# Altium project arduino_nano.PrjPcb
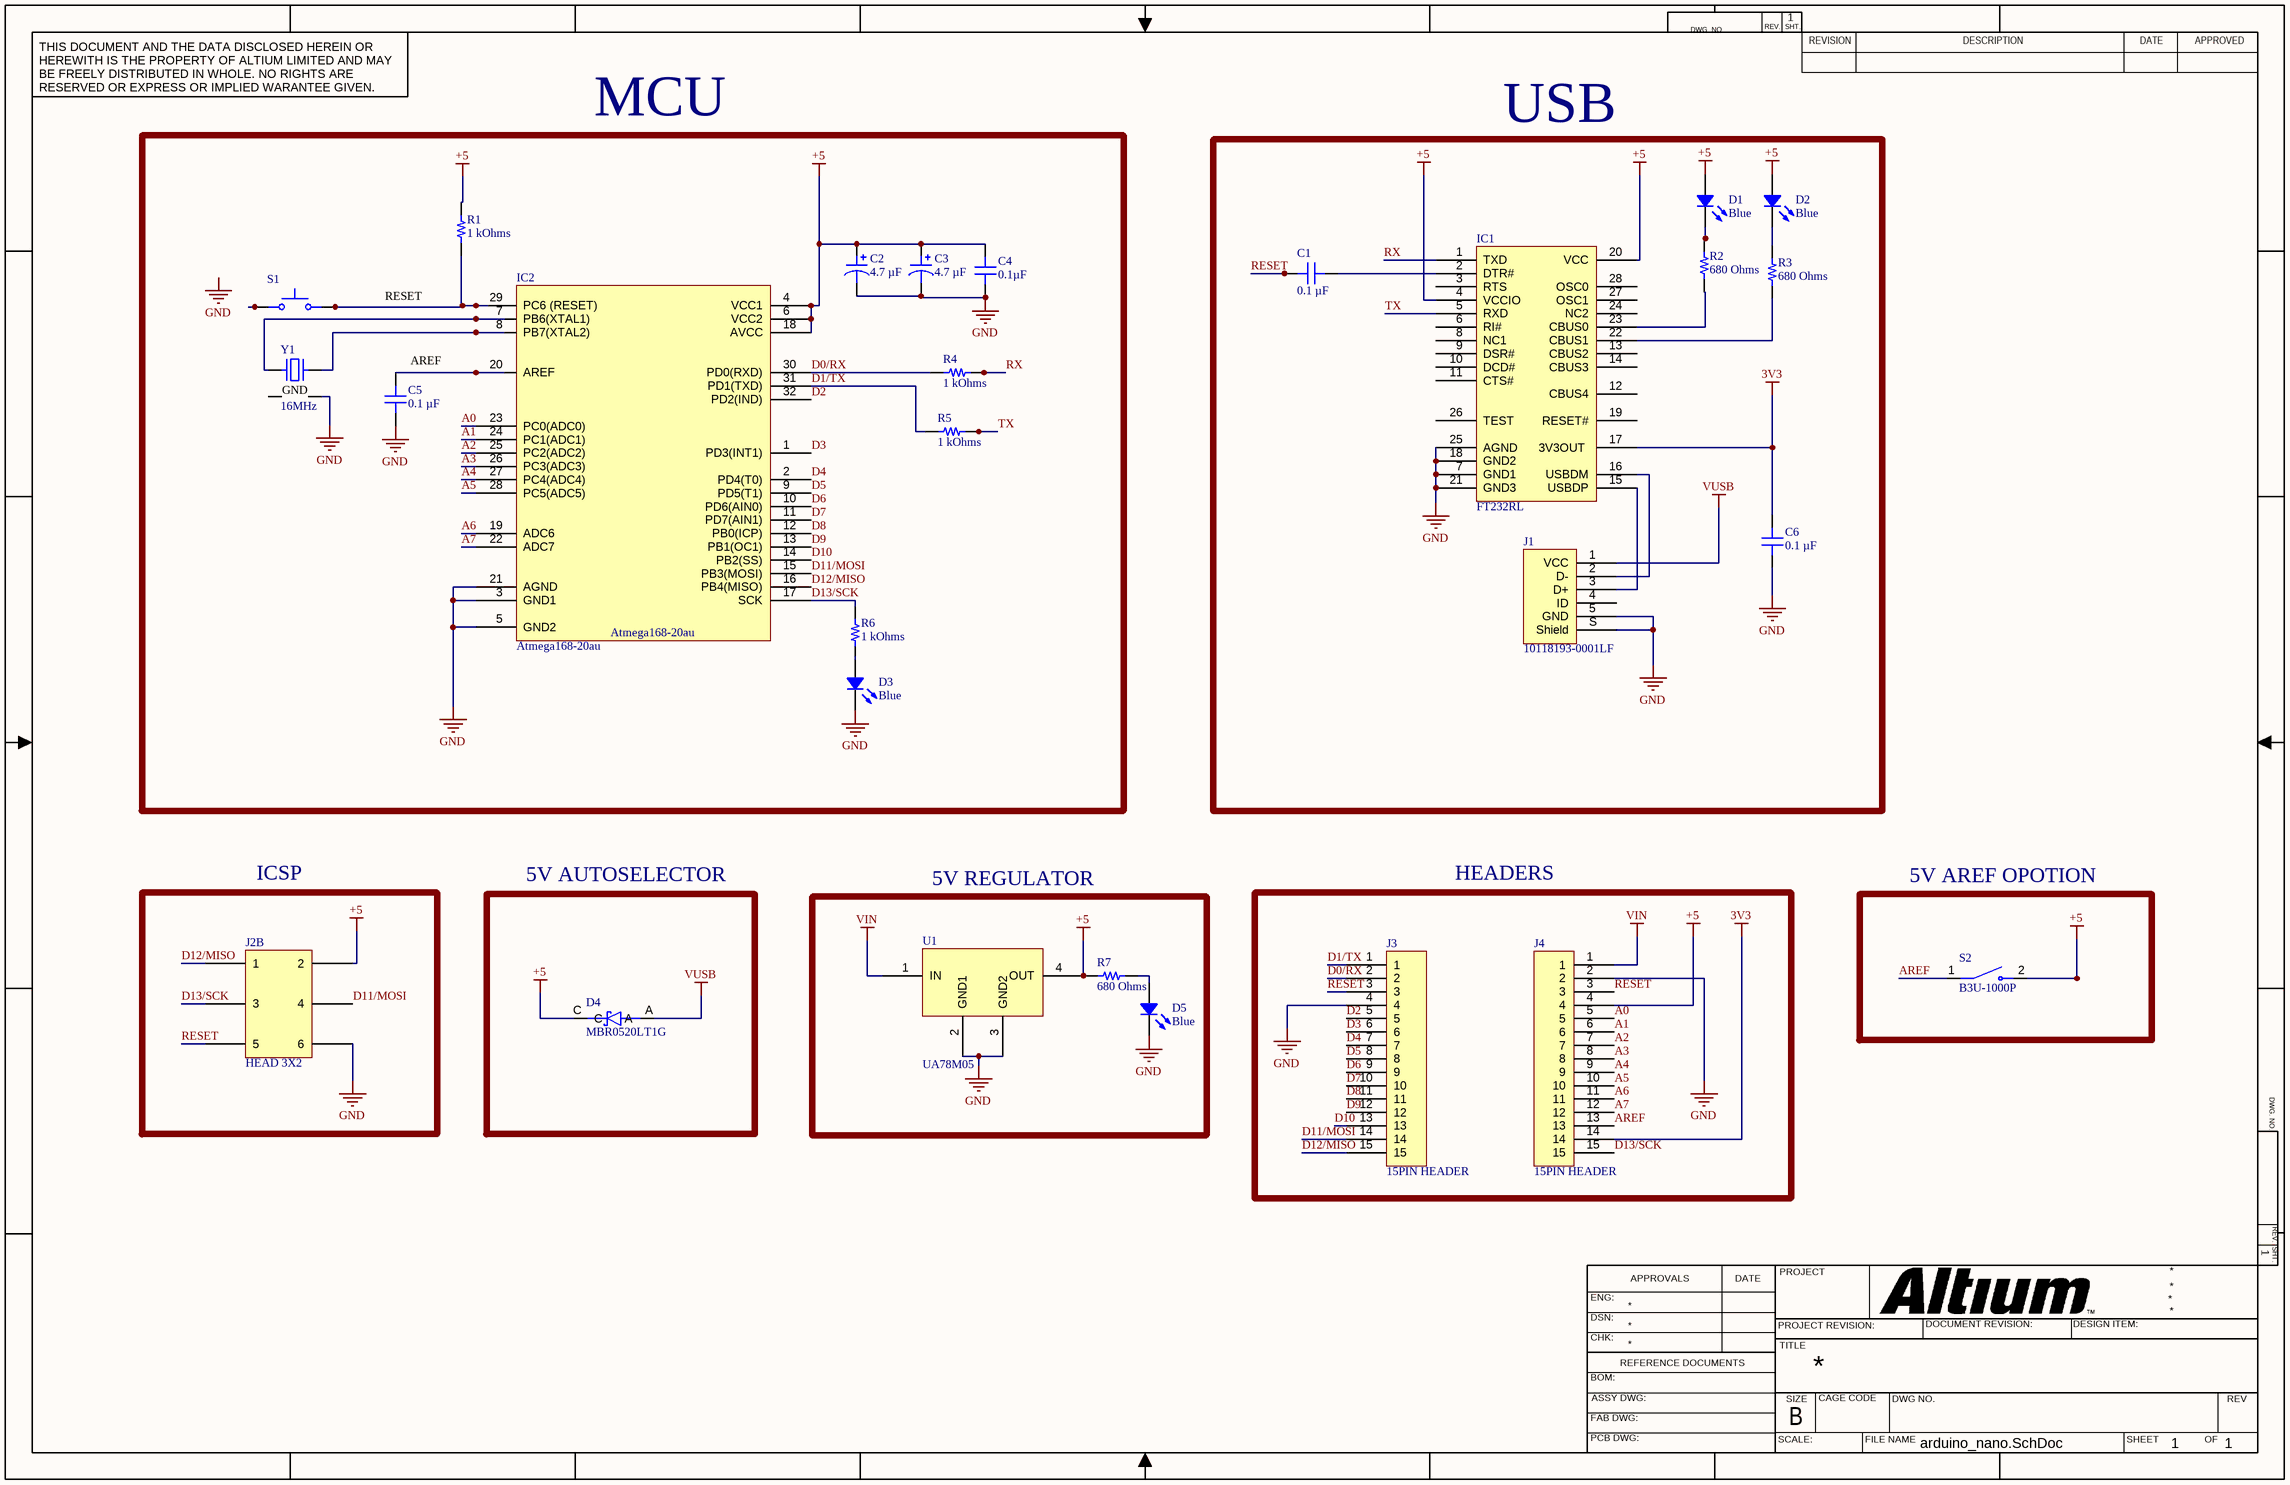
[diagram p0: arduino_nano.SchDoc]
1 sheet, 28 parts. Net scope: global (net labels, ports and power ports of the same name join across sheets).
Board file: arduino_nano.PcbDoc

## Sheet arduino_nano.SchDoc
size 431 x 279 mm; SheetNumber: 1; SheetTotal: 1

### Parts
C1  0.1 µF  [CAP 0402_1005]
C2  4.7 µF  [CAP POL 1411_3528]
C3  4.7 µF  [CAP POL 1411_3528]
C4  0.1µF  [CAP 0402_1005]
C5  0.1 µF  [CAP 0402_1005]
C6  0.1 µF  [CAP 0402_1005]
D1  Blue  [LED 0805_2012 BLUE]
D2  Blue  [LED 0805_2012 BLUE]
D3  Blue  [LED 0805_2012 BLUE]
D4  MBR0520LT1G  [SOD3716X135N]
D5  Blue  [LED 0805_2012 BLUE]
IC1  FT232RL  [FT232RL]
IC2  Atmega168-20au  [atmega168-20au]
J1  10118193-0001LF  [FCI USB 10118193-0001LF]
J2  HEAD 3X2  [Header 3x2]  (part B of 2)
J3  15PIN HEADER  [header 1x15]
J4  15PIN HEADER  [header 1x15]
R1  1 kOhms  [RES 0201_0603]
R2  680 Ohms  [RES 0201_0603]
R3  680 Ohms  [RES 0201_0603]
R4  1 kOhms  [RES 0201_0603]
R5  1 kOhms  [RES 0201_0603]
R6  1 kOhms  [RES 0201_0603]
R7  680 Ohms  [RES 0201_0603]
S1  TL3315NF100Q  [SW_TL3315NF100Q]  (value not drawn)
S2  B3U-1000P  [SW_B3U-1000P]
U1  UA78M05  [UA78M05]
Y1  16MHz  [ABRACON ABM10]

### Blocks framed on the sheet
MCU: C2-C5 D3 IC2 R1 R4-R6 S1 Y1
USB: C1 C6 D1 D2 IC1 J1 R2 R3
ICSP: J2
5V AUTOSELECTOR: D4
5V REGULATOR: D5 R7 U1
HEADERS: J3 J4
5V AREF OPOTION: S2

### Nets
3V3: C6.1 IC1.17(3V3OUT) J4.14
+5: C2.1 C3.1 C4.2 D1.1 D2.1 D4.C IC1.4(VCCIO) IC1.20(VCC) IC2.4(VCC1) IC2.6(VCC2) IC2.18(AVCC) J2.2 J4.4 R1.1 R7.2 S2.2 U1.4(OUT)
GND: C2.2 C3.2 C4.1 C5.2 C6.2 D3.2 D5.2 IC1.7(GND1) IC1.18(GND2) IC1.21(GND3) IC1.25(AGND) IC2.3(GND1) IC2.5(GND2) IC2.21(AGND) J1.5(GND) J1.S(Shield) J2.6 J3.4 J4.2 U1.2(GND1) U1.3(GND2) Y1.2(GND)
VIN: J4.1 U1.1(IN)
VUSB: D4.A J1.1(VCC)
A0: IC2.23(PC0(ADC0)) J4.5
A1: IC2.24(PC1(ADC1)) J4.6
A2: IC2.25(PC2(ADC2)) J4.7
A3: IC2.26(PC3(ADC3)) J4.8
A4: IC2.27(PC4(ADC4)) J4.9
A5: IC2.28(PC5(ADC5)) J4.10
A6: IC2.19(ADC6) J4.11
A7: IC2.22(ADC7) J4.12
AREF: J4.13 S2.1
D0/RX: IC2.30(PD0(RXD)) J3.2 R4.2
D1/TX: IC2.31(PD1(TXD)) J3.1 R5.2
D2: IC2.32(PD2(IND)) J3.5
D3: IC2.1(PD3(INT1)) J3.6
D4: IC2.2(PD4(T0)) J3.7
D5: IC2.9(PD5(T1)) J3.8
D6: IC2.10(PD6(AIN0)) J3.9
D7: IC2.11(PD7(AIN1)) J3.10
D8: IC2.12(PB0(ICP)) J3.11
D9: IC2.13(PB1(OC1)) J3.12
D10: IC2.14(PB2(SS)) J3.13
D11/MOSI: IC2.15(PB3(MOSI)) J2.4 J3.14
D12/MISO: IC2.16(PB4(MISO)) J2.1 J3.15
D13/SCK: IC2.17(SCK) J2.3 J4.15 R6.1
RESET: C1.1 J2.5 J3.3 J4.3
RX: IC1.1(TXD) R4.1
TX: IC1.5(RXD) R5.1
NetC1_2: C1.2 IC1.2(DTR#)
NetC5_1: C5.1 IC2.20(AREF)
NetD1_2: D1.2 R2.2
NetD2_2: D2.2 R3.2
NetD3_1: D3.1 R6.2
NetD5_1: D5.1 R7.1
NetIC1_15: IC1.15(USBDP) J1.3(D+)
NetIC1_16: IC1.16(USBDM) J1.2(D-)
NetIC1_22: IC1.22(CBUS1) R3.1
NetIC1_23: IC1.23(CBUS0) R2.1
NetIC2_7: IC2.7(PB6(XTAL1)) Y1.1
NetIC2_8: IC2.8(PB7(XTAL2)) Y1.3
NetIC2_29: IC2.29(PC6_(RESET)) R1.2 S1.3 S1.4
NetS1_1: S1.1 S1.2

Not connected (* = marked no-connect by the designer): IC1 3(RTS) 6(RI#) 8(NC1) 9(DSR#) 10(DCD#) 11(CTS#) 12(CBUS4) 13(CBUS2) 14(CBUS3) 19(RESET#) 24(NC2) 26(TEST) 27(OSC1) 28(OSC0); J1 4(ID); Y1 4(GND)

### Notes on the sheet
- Labels drawn without touching a wire or pin: AREF, GND, RESET
- DWG. NO.
- REV.
- SHT.
- THIS DOCUMENT AND THE DATA DISCLOSED HEREIN OR HEREWITH IS THE PROPERTY OF ALTIUM LIMITED AND MAY BE FREELY DISTRIBUTED IN WHOLE. NO RIGHTS ARE RESERVED OR EXPRESS OR IMPLIED WARANTEE GIVEN.
- REVISION
- DESCRIPTION
- DATE
- APPROVED
- ENG:
- APPROVALS
- PROJECT
- DSN:
- CHK:
- REFERENCE DOCUMENTS
- PROJECT REVISION:
- TITLE
- DOCUMENT REVISION:
- DESIGN ITEM:
- BOM:
- FAB DWG:
- PCB DWG:
- ASSY DWG:
- SCALE:
- SIZE
- B
- CAGE CODE
- FILE NAME
- DWG NO.
- SHEET
- OF
- REV

### Library data of the parts
C1 C6 = GCQ1555C1HR62CB01D: CAP CER 0.62PF 50V C0G/NP0 0402; manufacturer: Murata Electronics; Temperature Coefficient: C0G, NP0; Tolerance: ±0.25pF; Part Number: GCQ1555C1HR62CB01D; Value: 0.1 µF; Applications: RF, Microwave, High Frequency, Automotive; Capacitance: 0.62 pF; componentlink1description: Datasheet; componentlink1url: https://search.murata.co.jp/Ceramy/image/img/A01X/G101/ENG/GCQ1555C1HR62CB01-01.pdf; componentlink2description: DigiKey Link; componentlink2url: https://www.digikey.com/en/products/detail/murata-electronics/GCQ1555C1HR62CB01D/7803284; Device Package: 0402 (1005 Metric); lastupdated: 9/19/2022 12:57:24 PM; Lifecycle Status: Active; Minimum Order: 1; Mounting Type: Surface Mount, MLCC; Operating Temperature: -55°C ~ 125°C; Package / Case: 0402 (1005 Metric); packaging: TapeAndReel; partid: 41932; Part Status: Active; price: 0.04; Ratings: AEC-Q200; series: GCQ; Size / Dimension: 0.039" L x 0.020" W (1.00mm x 0.50mm); Supplier 1: DigiKey; Supplier Part Number 1: 490-17557-1-ND; Thickness (Max): 0.022" (0.55mm); Voltage - Rated: 50V
C2 C3 = TR3B475K025C0700: CAP TANT 4.7UF 10% 25V 1411; manufacturer: Vishay Sprague; Manufacturer Size Code: B; ESR (Equivalent Series Resistance): 700mOhm; Type: Molded; Part Number: TR3B475K025C0700; Value: 4.7 µF; Capacitance: 4.7 µF; componentlink1description: Datasheet; componentlink1url: http://www.vishay.com/docs/40080/tr3.pdf; componentlink2description: DigiKey Link; componentlink2url: https://www.digikey.com/en/products/detail/vishay-sprague/TR3B475K025C0700/1859840; Device Package: 1411 (3528 Metric); Features: General Purpose; Height - Seated (Max): 0.083" (2.11mm); lastupdated: 9/1/2022 1:05:26 PM; Lifecycle Status: Active; Minimum Order: 1; Mounting Type: Surface Mount; Operating Temperature: -55°C ~ 125°C; Package / Case: 1411 (3528 Metric); packaging: TapeAndReel; partid: 2; Part Status: Active; price: 0.46; series: TANTAMOUNT®, TR3; Size / Dimension: 0.138" L x 0.110" W (3.50mm x 2.80mm); Supplier 1: DigiKey; Supplier Part Number 1: 718-1523-1-ND; Tolerance: ±10%; Voltage - Rated: 25 V
C4 = 885012205051: CAP CER 0.015UF 25V X7R 0402; manufacturer: Würth Elektronik; Capacitance: 0.015 µF; Tolerance: ±10%; Part Number: 885012205051; Value: 0.1µF; Applications: General Purpose; componentlink1description: Datasheet; componentlink1url: https://katalog.we-online.de/pbs/datasheet/885012205051.pdf; componentlink2description: DigiKey Link; componentlink2url: https://www.digikey.com/en/products/detail/würth-elektronik/885012205051/5453401; Device Package: 0402 (1005 Metric); lastupdated: 9/19/2022 12:57:34 PM; Lifecycle Status: Active; Minimum Order: 1; Mounting Type: Surface Mount, MLCC; Operating Temperature: -55°C ~ 125°C; Package / Case: 0402 (1005 Metric); packaging: TapeAndReel; partid: 2017; Part Status: Active; price: 0.02; series: WCAP-CSGP; Size / Dimension: 0.039" L x 0.020" W (1.00mm x 0.50mm); Supplier 1: DigiKey; Supplier Part Number 1: 732-7546-1-ND; Temperature Coefficient: X7R; Thickness (Max): 0.022" (0.55mm); Voltage - Rated: 25V
C5 = C0402C151F5GAC7867: CAP CER 150PF 50V NP0 0402; manufacturer: KEMET; Temperature Coefficient: C0G, NP0; Tolerance: ±1%; Part Number: C0402C151F5GAC7867; Value: 0.1 µF; Applications: General Purpose; Capacitance: 150 pF; componentlink1description: Datasheet; componentlink1url: https://api.kemet.com/component-edge/download/datasheet/C0402C151F5GAC7867.pdf; componentlink2description: DigiKey Link; componentlink2url: https://www.digikey.com/en/products/detail/kemet/C0402C151F5GAC7867/2196312; Device Package: 0402 (1005 Metric); Features: Low ESL; lastupdated: 9/19/2022 12:57:36 PM; Lifecycle Status: Active; Minimum Order: 1; Mounting Type: Surface Mount, MLCC; Operating Temperature: -55°C ~ 125°C; Package / Case: 0402 (1005 Metric); packaging: TapeAndReel; partid: 1709; Part Status: Active; price: 0.43; series: SMD Comm C0G; Size / Dimension: 0.039" L x 0.020" W (1.00mm x 0.50mm); Supplier 1: DigiKey; Supplier Part Number 1: 399-14269-1-ND; Thickness (Max): 0.022" (0.55mm); Voltage - Rated: 50V
D1-D3 D5 = 5975606507F: LED BLUE 0805 SMD; Manufacturer: Dialight; Configuration: Standard; Current - Test: 5mA; Lens Color: 0.93mm; Lens Size: 1.40mm x 1.24mm; Lens Style: Rectangle with Flat Top; Millicandela Rating: 36mcd; Voltage - Forward (Vf) (Typ): 2.9V; Wavelength - Dominant: 470nm; Part Number: 5975606507F; Color: Blue; ComponentLink1Description: Datasheet; ComponentLink1URL: http://www.dialightsignalsandcomponents.com/Assets/Drawings/2D_Drawings_DrawingDetailedSpec/NewDrawings/18370A.pdf; ComponentLink2Description: DigiKey Link; ComponentLink2URL: https://www.digikey.com/en/products/detail/dialight/5975606507F/9385445; Device Package: 0805 (2012 Metric); Height (Max): 0.93mm; LastUpdated: 9/1/2022 1:14:53 PM; Lifecycle Status: Active; Minimum Order: 1; Mounting Type: Surface Mount; Package / Case: 0805 (2012 Metric); Packaging: TapeAndReel; PartId: 753; Part Status: Active; Price: 0.14; Series: 597; Size / Dimension: 2.00mm L x 1.25mm W; Supplier 1: DigiKey; Supplier Part Number 1: 350-4390-1-ND; Supplier Device Package: 0805; Value: Blue
D4 = MBR0520LT1G: Rectifier, Schottky Power; Plastic Sod-123; 0.5 a @ +90c If; +125; 20v; 1000; Package: None; MP: MBR0520LT1G; Value: *; Price: None; Availability: Unavailable
J1 = 10118193-0001LF: CONN RCPT USB2.0 MICRO B SMD R/A; Manufacturer: Amphenol ICC (FCI); Connector Type: USB - micro B; Current Rating (Amps): 1.8A per Contact; Gender: Receptacle; Mating Cycles: 10000; Number of Contacts: 5; Number of Ports: 1; Shielding: Shielded; Voltage - Rated: 100VAC; Part Number: 10118193-0001LF; ComponentLink1Description: Datasheet; ComponentLink1URL: https://cdn.amphenol-icc.com/media/wysiwyg/files/documentation/datasheet/inputoutput/io_usb_micro.pdf; ComponentLink2Description: DigiKey Link; ComponentLink2URL: //digikey.com/product-detail/en/amphenol-icc-fci/10118193-0001LF/609-4616-2-ND/2785388; Features: Solder Retention; LastUpdated: 12/9/2019 8:51:28 PM; Lifecycle Status: 0; Minimum Order: 1; Mounting Feature: Horizontal; Mounting Type: Surface Mount, Right Angle; Through Hole; Operating Temperature: -30°C ~ 80°C; Packaging: TapeAndReel; Part Status: Active; Price: 0.21; Series: -; Specifications: USB 2.0; Supplier 1: DigiKey; Supplier Part Number 1: 609-4616-2-ND; Termination: Solder
R1-R7 = 7-2176074-4: RES SMD 33.2KOHM 0.5% 1/32W 0201; Manufacturer: TE Connectivity Passive Product; Power (Watts): 0.03W, 1/32W; Resistance: 33.2 kOhms; Temperature Coefficient: ±50ppm/°C; Part Number: 7-2176074-4; ComponentLink1Description: Datasheet; ComponentLink1URL: https://www.te.com/commerce/DocumentDelivery/DDEController?Action=srchrtrv&DocNm=1773200&DocType=DS&DocLang=English; ComponentLink2Description: DigiKey Link; ComponentLink2URL: https://www.digikey.com/en/products/detail/te-connectivity-passive-product/7-2176074-4/4489517; Composition: Thin Film; Device Package: 0201 (0603 Metric); Height - Seated (Max): 0.011" (0.28mm); LastUpdated: 9/19/2022 1:09:18 PM; Lifecycle Status: Active; Minimum Order: 1; Number of Terminations: 2; Operating Temperature: -55°C ~ 155°C; Package / Case: 0201 (0603 Metric); Packaging: TapeAndReel; PartId: 1; Part Status: Active; Price: 0.10; Series: CPF, Neohm; Size / Dimension: 0.023" L x 0.011" W (0.58mm x 0.29mm); Supplier 1: DigiKey; Supplier Part Number 1: A129571CT-ND; Supplier Device Package: 0201; Tolerance: ±0.5%
  R1 R4-R6: Value: 1 kOhms
  R2 R3 R7: Value: 680 Ohms
S1 = TL3315NF100Q: Tactile Switch SPST-NO Top Actuated Surface Mount; MF: E-Switch; SnapEDA_Link: https://www.snapeda.com/parts/TL3315NF100Q/E-Switch/view-part/289310/?ref=snap; Availability: In Stock; Value: *; Check_prices: https://www.snapeda.com/parts/TL3315NF100Q/E-Switch/view-part/289310/?ref=eda; Purchase-URL: https://pricing.snapeda.com/search/part/TL3315NF100Q/?ref=eda; Package: None; Price: None; MP: TL3315NF100Q
S2 = B3U-1000P: Switch Tactile N.O. SPST Round Button Gull Wing 0.05A 12VDC 1.5N SMD Embossed T/R; Package: None; Availability: Unavailable; Value: *; MP: B3U-1000P; Price: None
Y1 = ABM10-16.000MHZ-E20-T: CRYSTAL 16.0000MHZ 10PF SMD; Manufacturer: Abracon LLC; ESR (Equivalent Series Resistance): 150 Ohms; Frequency Stability: ±20ppm; Operating Mode: Fundamental; Part Number: ABM10-16.000MHZ-E20-T; ComponentLink1Description: Datasheet; ComponentLink1URL: https://abracon.com/Resonators/ABM10.pdf; ComponentLink2Description: DigiKey Link; ComponentLink2URL: http://digikey.com/product-detail/en/abracon-llc/ABM10-16.000MHZ-E20-T/535-9810-1-ND/2001433; Device Package: 4-SMD, No Lead; Frequency: 16MHz; Frequency Tolerance: ±20ppm; Height - Seated (Max): 0.028" (0.70mm); LastUpdated: 3/19/2020 10:27:46 PM; Lifecycle Status: Active; Load Capacitance: 10pF; Minimum Order: 1; Mounting Type: Surface Mount; Operating Temperature: -20°C ~ 70°C; Package / Case: 4-SMD, No Lead; Packaging: TapeAndReel; PartId: 278; Part Status: Active; Price: 0.96; Series: ABM10; Size / Dimension: 0.098" L x 0.079" W (2.50mm x 2.00mm); Supplier 1: DigiKey; Supplier Part Number 1: 535-9810-1-ND; Type: MHz Crystal; Value: 16MHz